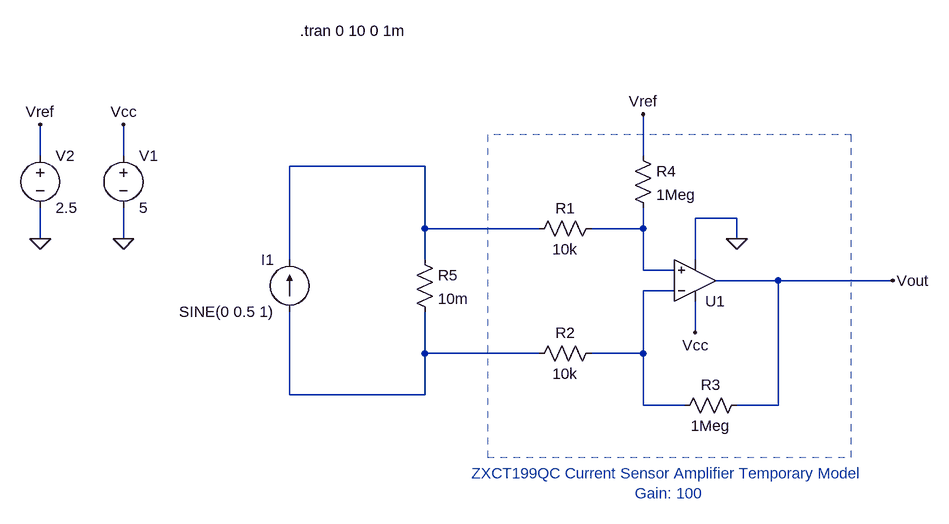
[diagram p0: schematic current_sensor.asc]
current_sensor.asc, the LTspice schematic file:
Version 4.1
SHEET 1 880 680
WIRE -672 -32 -672 -80
WIRE -544 -32 -544 -80
WIRE 256 -32 256 -96
WIRE -80 -16 -288 -16
WIRE 400 64 336 64
WIRE -80 80 -80 -16
WIRE 96 80 -80 80
WIRE 256 80 256 48
WIRE 256 80 176 80
WIRE -672 96 -672 48
WIRE -544 96 -544 48
WIRE 400 96 400 64
WIRE -288 128 -288 -16
WIRE -80 128 -80 80
WIRE 336 128 336 64
WIRE 256 144 256 80
WIRE 304 144 256 144
WIRE 464 160 368 160
WIRE 640 160 464 160
WIRE 304 176 256 176
WIRE 336 240 336 192
WIRE -80 272 -80 208
WIRE 96 272 -80 272
WIRE 256 272 256 176
WIRE 256 272 176 272
WIRE -288 336 -288 208
WIRE -80 336 -80 272
WIRE -80 336 -288 336
WIRE 256 352 256 272
WIRE 320 352 256 352
WIRE 464 352 464 160
WIRE 464 352 400 352
FLAG 400 96 0
FLAG -544 96 0
FLAG -544 -80 Vcc
FLAG 336 240 Vcc
FLAG -672 96 0
FLAG -672 -80 Vref
FLAG 256 -96 Vref
FLAG 640 160 Vout
SYMBOL OpAmps\\UniversalOpAmp2 336 160 M180
SYMATTR InstName U1
SYMBOL res -96 112 R0
SYMATTR InstName R5
SYMATTR Value 10m
SYMBOL res 192 64 R90
WINDOW 0 0 56 VBottom 2
WINDOW 3 32 56 VTop 2
SYMATTR InstName R1
SYMATTR Value 10k
SYMBOL res 192 256 R90
WINDOW 0 0 56 VBottom 2
WINDOW 3 32 56 VTop 2
SYMATTR InstName R2
SYMATTR Value 10k
SYMBOL voltage -544 -48 R0
WINDOW 123 0 0 Left 0
WINDOW 39 0 0 Left 0
SYMATTR InstName V1
SYMATTR Value 5
SYMBOL res 416 336 R90
WINDOW 0 0 56 VBottom 2
WINDOW 3 32 56 VTop 2
SYMATTR InstName R3
SYMATTR Value 1Meg
SYMBOL res 240 -48 R0
SYMATTR InstName R4
SYMATTR Value 1Meg
SYMBOL voltage -672 -48 R0
WINDOW 123 0 0 Left 0
WINDOW 39 0 0 Left 0
SYMATTR InstName V2
SYMATTR Value 2.5
SYMBOL current -288 208 R180
WINDOW 0 24 80 Left 2
WINDOW 3 24 0 Left 2
WINDOW 123 0 0 Left 0
WINDOW 39 0 0 Left 0
SYMATTR InstName I1
SYMATTR Value SINE(0 0.5 1)
TEXT -272 -224 Left 2 !.tran 0 10 0 1m
TEXT 296 472 Center 2 ;ZXCT199QC Current Sensor Amplifier Temporary Model\nGain: 100
RECTANGLE Normal 576 -64 16 432 2

The netlist it stands for:
* current_sensor.asc
X§U1 N002 N003 Vcc 0 Vout level2 Avol=1Meg GBW=10Meg Slew=10Meg Ilimit=25m Rail=0 Vos=0 En=0 Enk=0 In=0 Ink=0 Rin=500Meg  ; pins In+ In- V+ V- OUT
R5 N001 N004 10m
R1 N002 N001 10k
R2 N003 N004 10k
V1 Vcc 0 5
R3 Vout N003 1Meg
R4 Vref N002 1Meg
V2 Vref 0 2.5
I1 N004 N001 SINE(0 0.5 1)
.tran 0 10 0 1m
* ZXCT199QC Current Sensor Amplifier Temporary Model
* Gain: 100
.lib UniversalOpAmp2.lib
.backanno
.end